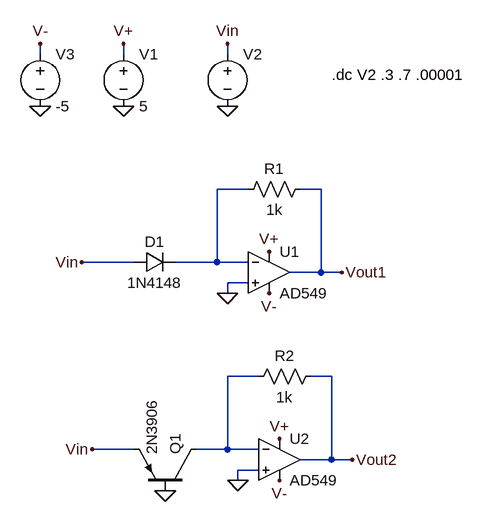
[diagram p0: schematic 04A-030.asc]
04A-030.asc, the LTspice schematic file:
Version 4.1
SHEET 1 880 680
WIRE 16 -176 16 -192
WIRE 144 -176 144 -192
WIRE 304 -176 304 -192
WIRE 336 32 288 32
WIRE 448 32 416 32
WIRE 160 144 80 144
WIRE 288 144 288 32
WIRE 288 144 224 144
WIRE 336 144 288 144
WIRE 448 160 448 32
WIRE 448 160 400 160
WIRE 480 160 448 160
WIRE 336 176 304 176
WIRE 304 192 304 176
WIRE 352 320 304 320
WIRE 464 320 432 320
WIRE 160 432 96 432
WIRE 304 432 304 320
WIRE 304 432 256 432
WIRE 352 432 304 432
WIRE 464 448 464 320
WIRE 464 448 416 448
WIRE 496 448 464 448
WIRE 352 464 320 464
WIRE 320 480 320 464
FLAG 368 128 V+
FLAG 304 192 0
FLAG 80 144 Vin
FLAG 480 160 Vout1
FLAG 144 -96 0
FLAG 144 -192 V+
FLAG 304 -96 0
FLAG 304 -192 Vin
FLAG 16 -96 0
FLAG 16 -192 V-
FLAG 368 192 V-
FLAG 384 416 V+
FLAG 320 480 0
FLAG 96 432 Vin
FLAG 496 448 Vout2
FLAG 384 480 V-
FLAG 208 496 0
SYMBOL res 432 16 R90
WINDOW 0 0 56 VBottom 2
WINDOW 3 32 56 VTop 2
SYMATTR InstName R1
SYMATTR Value 1k
SYMBOL voltage 144 -192 R0
WINDOW 123 0 0 Left 0
WINDOW 39 0 0 Left 0
SYMATTR InstName V1
SYMATTR Value 5
SYMBOL voltage 304 -192 R0
WINDOW 123 0 0 Left 0
WINDOW 39 0 0 Left 0
SYMATTR InstName V2
SYMATTR Value ""
SYMBOL OpAmps\\AD549 368 96 R0
SYMATTR InstName U1
SYMBOL diode 160 160 R270
WINDOW 0 32 32 VTop 2
WINDOW 3 0 32 VBottom 2
SYMATTR InstName D1
SYMATTR Value 1N4148
SYMBOL voltage 16 -192 R0
WINDOW 123 0 0 Left 0
WINDOW 39 0 0 Left 0
SYMATTR InstName V3
SYMATTR Value -5
SYMBOL res 448 304 R90
WINDOW 0 0 56 VBottom 2
WINDOW 3 32 56 VTop 2
SYMATTR InstName R2
SYMATTR Value 1k
SYMBOL OpAmps\\AD549 384 384 R0
SYMATTR InstName U2
SYMBOL pnp 256 496 M270
SYMATTR InstName Q1
SYMATTR Value 2N3906
TEXT 464 -144 Left 2 !.dc V2 .3 .7 .00001

The netlist it stands for:
* 04A-030.asc
R1 Vout1 N001 1k
V1 V+ 0 5
V2 Vin 0
X§U1 0 N001 V+ V- Vout1 AD549  ; pins In+ In- V+ V- OUT
D1 Vin N001 1N4148
V3 V- 0 -5
R2 Vout2 N002 1k
X§U2 0 N002 V+ V- Vout2 AD549  ; pins In+ In- V+ V- OUT
Q1 N002 0 Vin 0 2N3906
.model D D
.lib standard.dio
.model NPN NPN
.model PNP PNP
.lib standard.bjt
.dc V2 .3 .7 .00001
.backanno
.end